# EasyEDA schematic 1-Schematic_FireSmartFloorHeater - Control Board.json

## Sheets
1 ControlBoard: TITLE: FireSmartFloorHeater - Control board; REV: 1.0; Date: 2019-12-23; Sheet: 1/1; Company: http://davidstein.cz
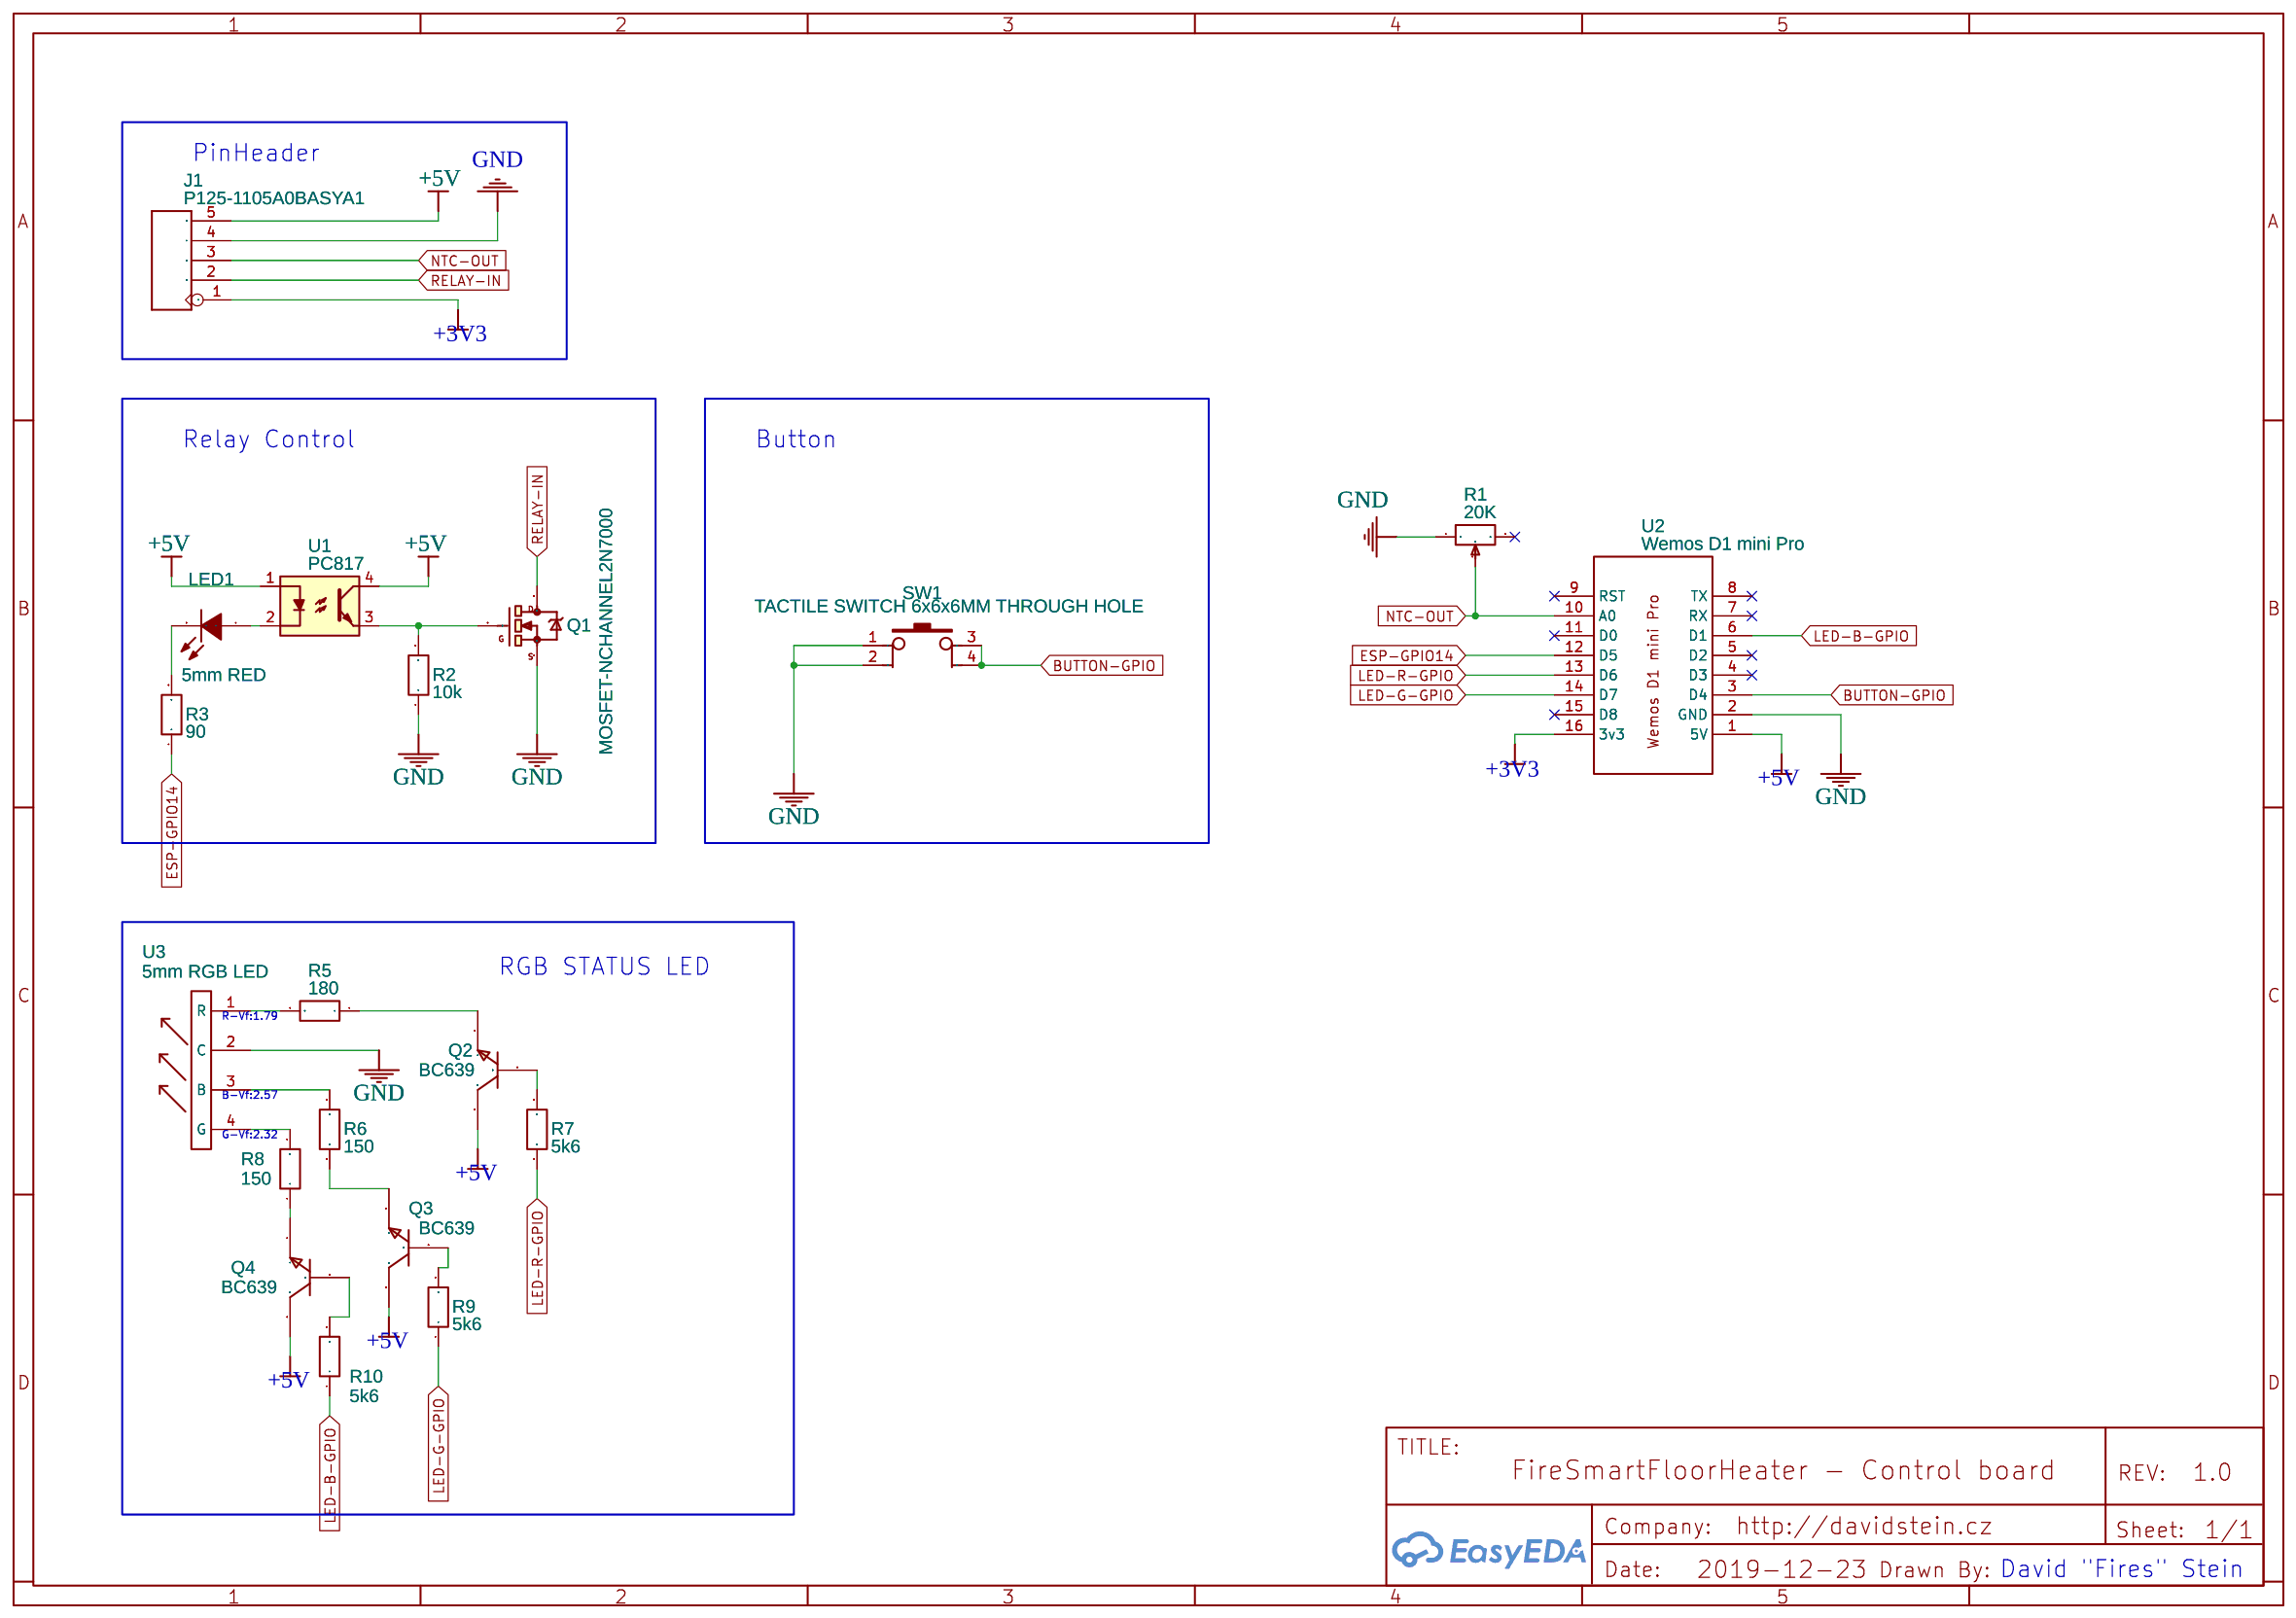
[diagram p0: ControlBoard]
2 PowerBoard: TITLE: PowerBoard; Date: 2022-08-01; Drawn By: David "Fires" Stein
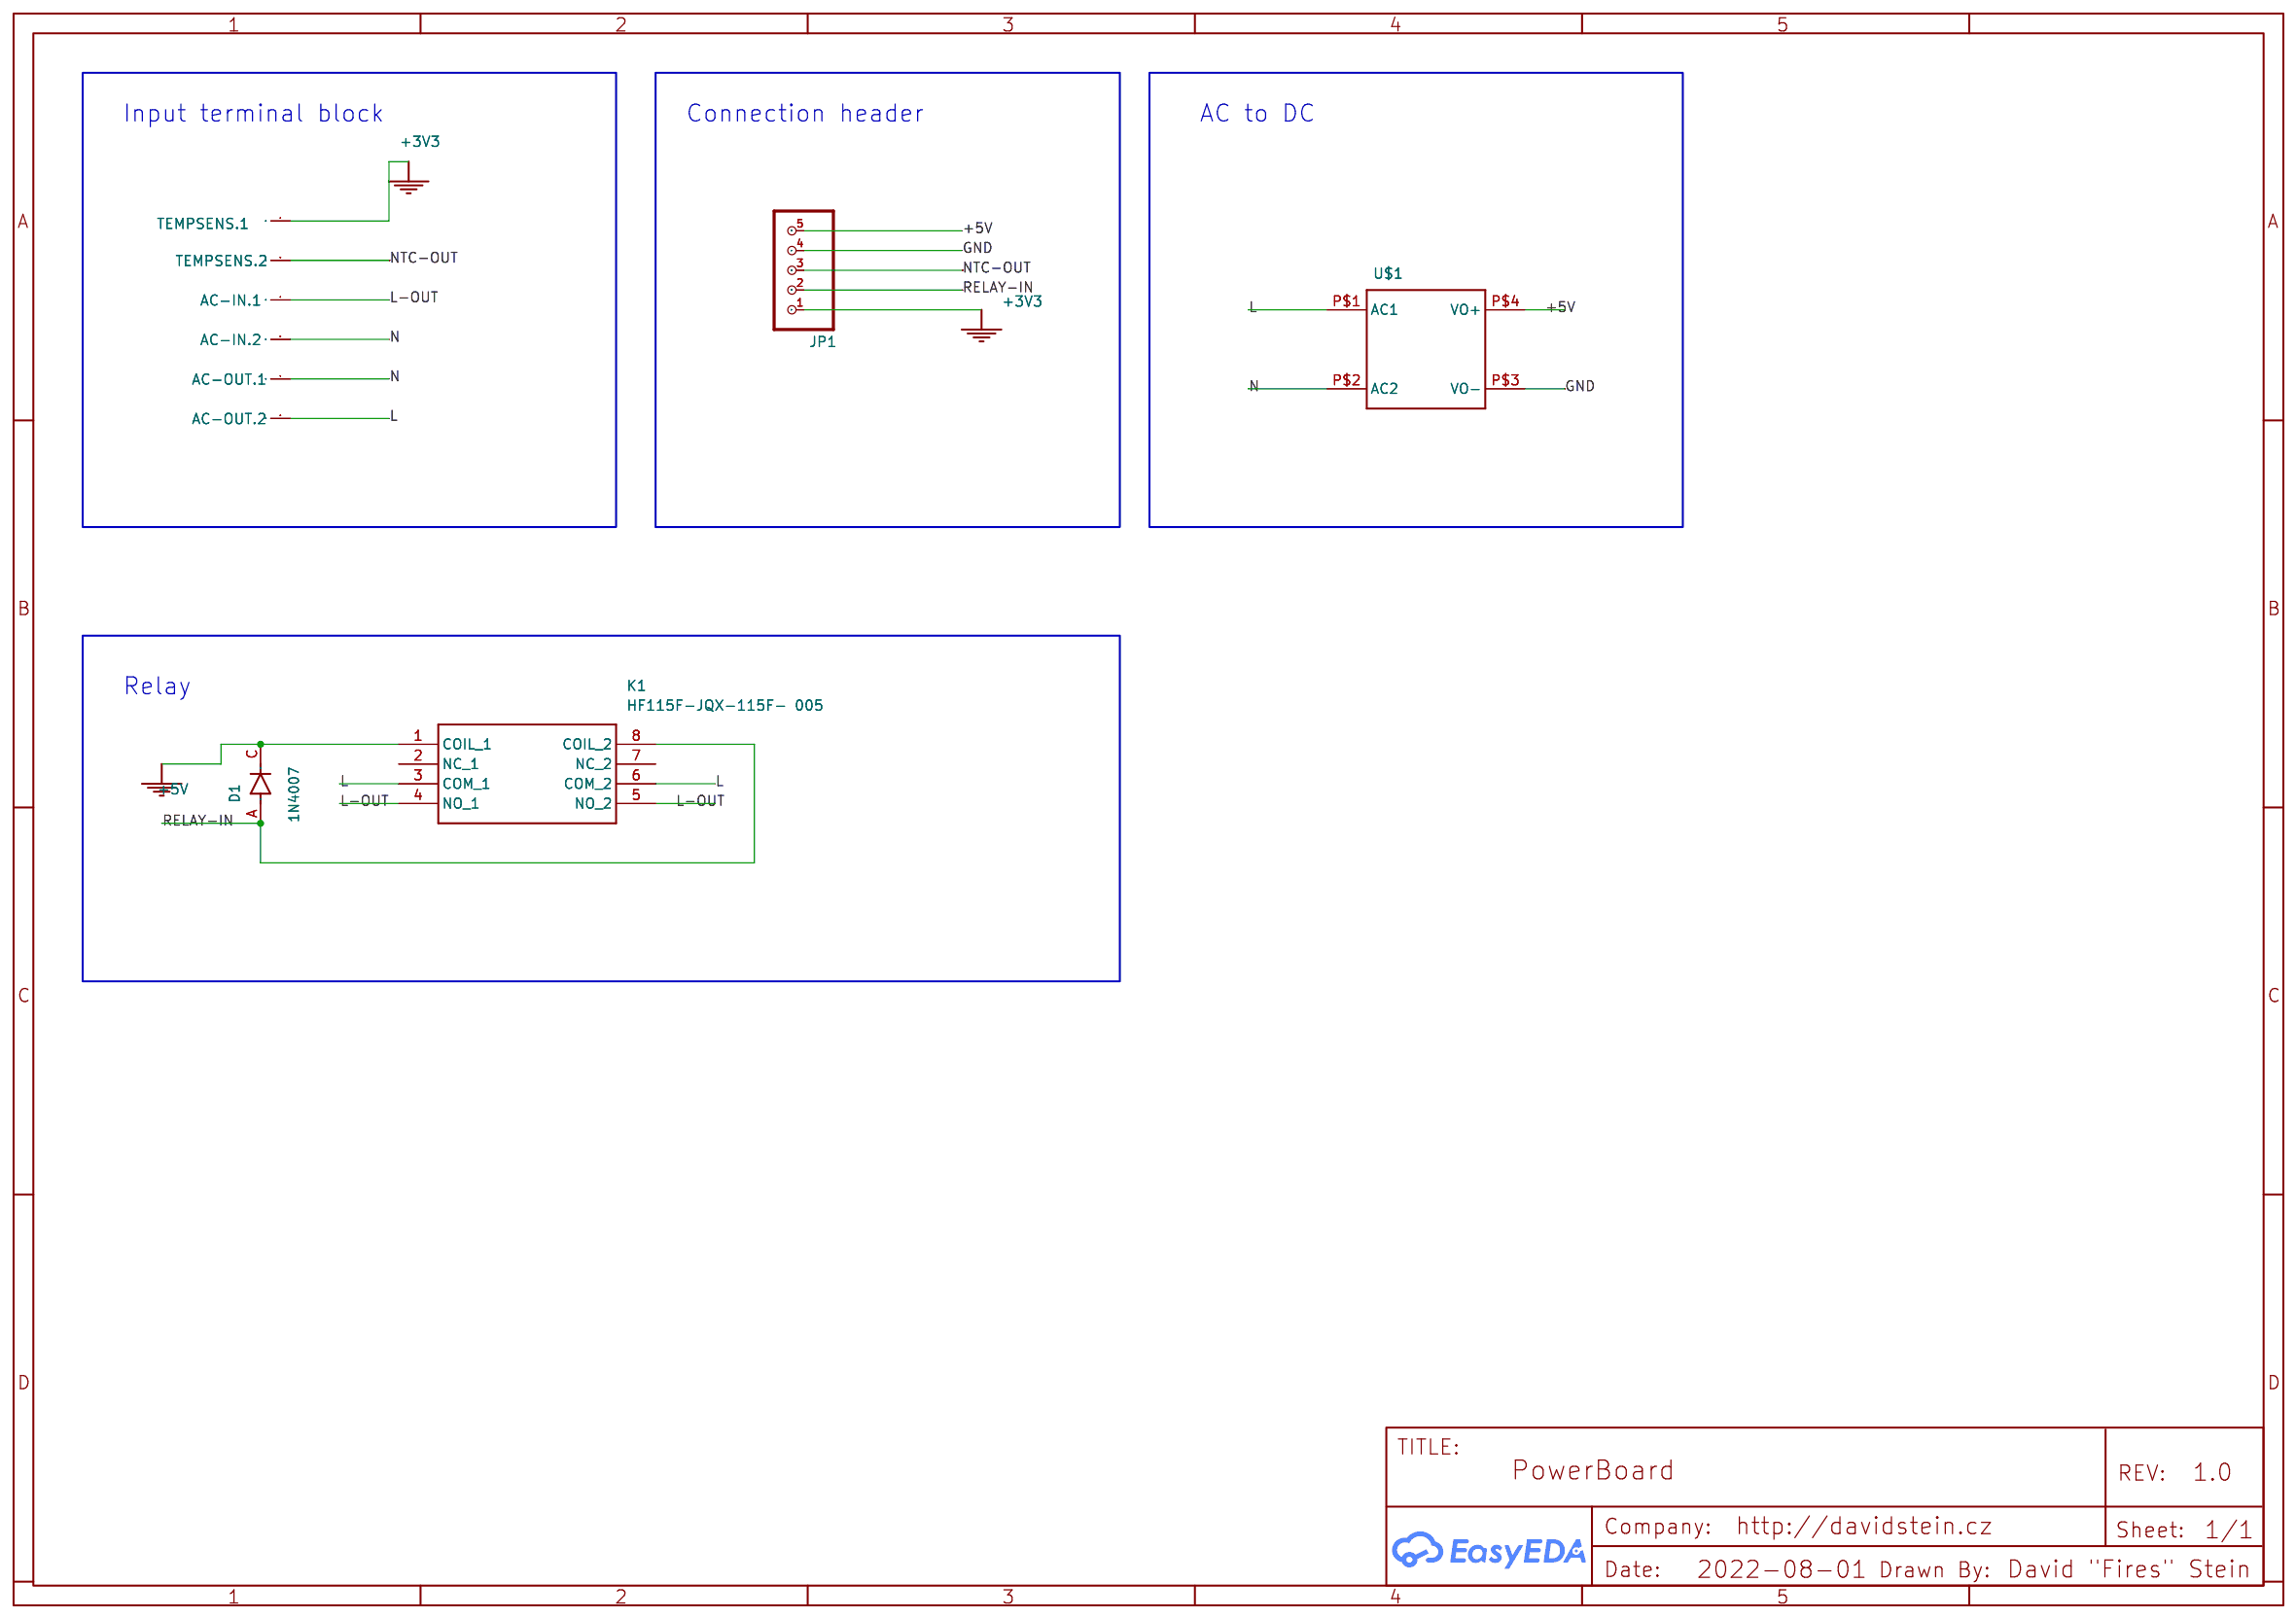
[diagram p1: PowerBoard]

## Parts
sheet ControlBoard
J1  P125-1105A0BASYA1  [H5-2.54]
LED1  5mm RED  [LED-5MM/2.54]
Q1  MOSFET-NCHANNEL2N7000  [TO-92]
Q2  BC639  [TO92-INLINE]
Q3  BC639  [TO92-INLINE]
Q4  BC639  [TO92-INLINE]
R1  20K  [RES-ADJ-TH_3P-L10.0-W10.0-P2.50-BL-BS]
R2  10k  [AXIAL-0.3]
R3  90  [AXIAL-0.3]
R5  180  [AXIAL-0.3]
R6  150  [AXIAL-0.3]
R7  5k6  [AXIAL-0.3]
R8  150  [AXIAL-0.3]
R9  5k6  [AXIAL-0.3]
R10  5k6  [AXIAL-0.3]
SW1  TACTILE SWITCH 6x6x6MM THROUGH HOLE  [SW_4PIN_6X6X6_THROUGHHOLE]
U1  PC817  [DIP-4_W7.62MM]
U2  Wemos D1 mini Pro  [WEMOD D1 MINI PRO]
U3  5mm RGB LED  [5MM RGB LED]
sheet PowerBoard
AC-IN.1  AK500/2  [AK500/2]
AC-IN.2  AK500/2  [AK500/2]
AC-OUT.1  AK500/2  [AK500/2]
AC-OUT.2  AK500/2  [AK500/2]
D1  1N4007  [DIOAD1060W80L520D270]
JP1  PINHD-1X5  [1X05]
K1  HF115F-JQX-115F- 005  [HF115FK242Z4T610]
TEMPSENS.1  AK500/2  [AK500/2]
TEMPSENS.2  AK500/2  [AK500/2]
U$1  HLK-PM01  [HLK-PM01]

## Library data of the parts
J1 = -: DIP Black Male Header;
LED1 = -: Supplier: LCSC; Manufacturer: EVERLIGHT; Manufacturer Part: 204-10SURD/S530-A3; Supplier Part: C99772
Q1 = -: Common NMOSFET Parts; Contributor: SparkFun
Q2-Q4 = -: High Current Transistor NPN Silicon
R1 = 3296W-1-203LF: Supplier: LCSC; Manufacturer: BOURNS; Supplier Part: C34845
R2 R3 R5-R10 = Res_AXIAL-0.3(1/8W)_EU
SW1 = -: Supplier Part: C23873; Supplier: LCSC; Manufacturer: ReliaPro; Manufacturer Part: SMD Tactile Switch6*6*6mm; image: http://image.lceda.cn/szlcsc/C23873.jpg
U1 = -: Contributor: KiCAD; license: https://www.gnu.org/licenses/lgpl-2.1.html
U2 = -: Contributor: PiotrMk
U3 = -: Contributor: HenryPenton

## Nets
+3V3: J1.1 JP1.1 TEMPSENS.1.1(KL) U2.16(3v3)
+5V: D1.C J1.5 JP1.5 K1.1(COIL) Q2.2(C) Q3.2(C) Q4.2(C) U1.1 U1.4 U2.1(5V) U$1.P$4(VO+)
GND: J1.4 JP1.4 Q1.1(S) R1.1 R2.1 SW1.1 SW1.2 U2.2(GND) U3.2(C) U$1.P$3(VO-)
BUTTON-GPIO: SW1.3 SW1.4 U2.3(D4)
ESP-GPIO14: R3.1 U2.12(D5)
L: AC-OUT.2.2(KL) K1.3(COM_1) K1.6(COM_2) U$1.P$1(AC1)
L-OUT: AC-IN.1.1(KL) K1.4(NO_1) K1.5(NO_2)
LED-B-GPIO: R10.1 U2.6(D1)
LED-G-GPIO: R9.1 U2.14(D7)
LED-R-GPIO: R7.1 U2.13(D6)
N: AC-IN.2.2(KL) AC-OUT.1.1(KL) U$1.P$2(AC2)
NTC-OUT: J1.3 JP1.3 R1.2 TEMPSENS.2.2(KL) U2.10(A0)
RELAY-IN: D1.A J1.2 JP1.2 K1.8(COIL_2) Q1.3(D)
Net-(LED1-1): LED1.1(A) U1.2
Net-(LED1-2): LED1.2(K) R3.2
Net-(Q1-2): Q1.2(G) R2.2 U1.3
Net-(Q2-1): Q2.1(E) R5.1
Net-(Q2-3): Q2.3(B) R7.2
Net-(Q3-1): Q3.1(E) R6.1
Net-(Q3-3): Q3.3(B) R9.2
Net-(Q4-1): Q4.1(E) R8.1
Net-(Q4-3): Q4.3(B) R10.2
Net-(R5-2): R5.2 U3.1(R)
Net-(R6-2): R6.2 U3.3(B)
Net-(R8-2): R8.2 U3.4(G)

Not connected (* = marked no-connect by the designer): K1 2(NC_1) 7(NC_2); R1 3*; U2 4(D3)* 5(D2)* 7(RX)* 8(TX)* 9(RST)* 11(D0)* 15(D8)*

## Notes on the sheets
sheet 1
- PinHeader
- Relay Control
- Button
- RGB STATUS LED
- R-Vf:1.79
- B-Vf:2.57
- G-Vf:2.32
- David "Fires" Stein
sheet 2
- Input terminal block
- Connection header
- AC to DC
- Relay
